# EAGLE design transmisor (EAGLE 7.6.0)
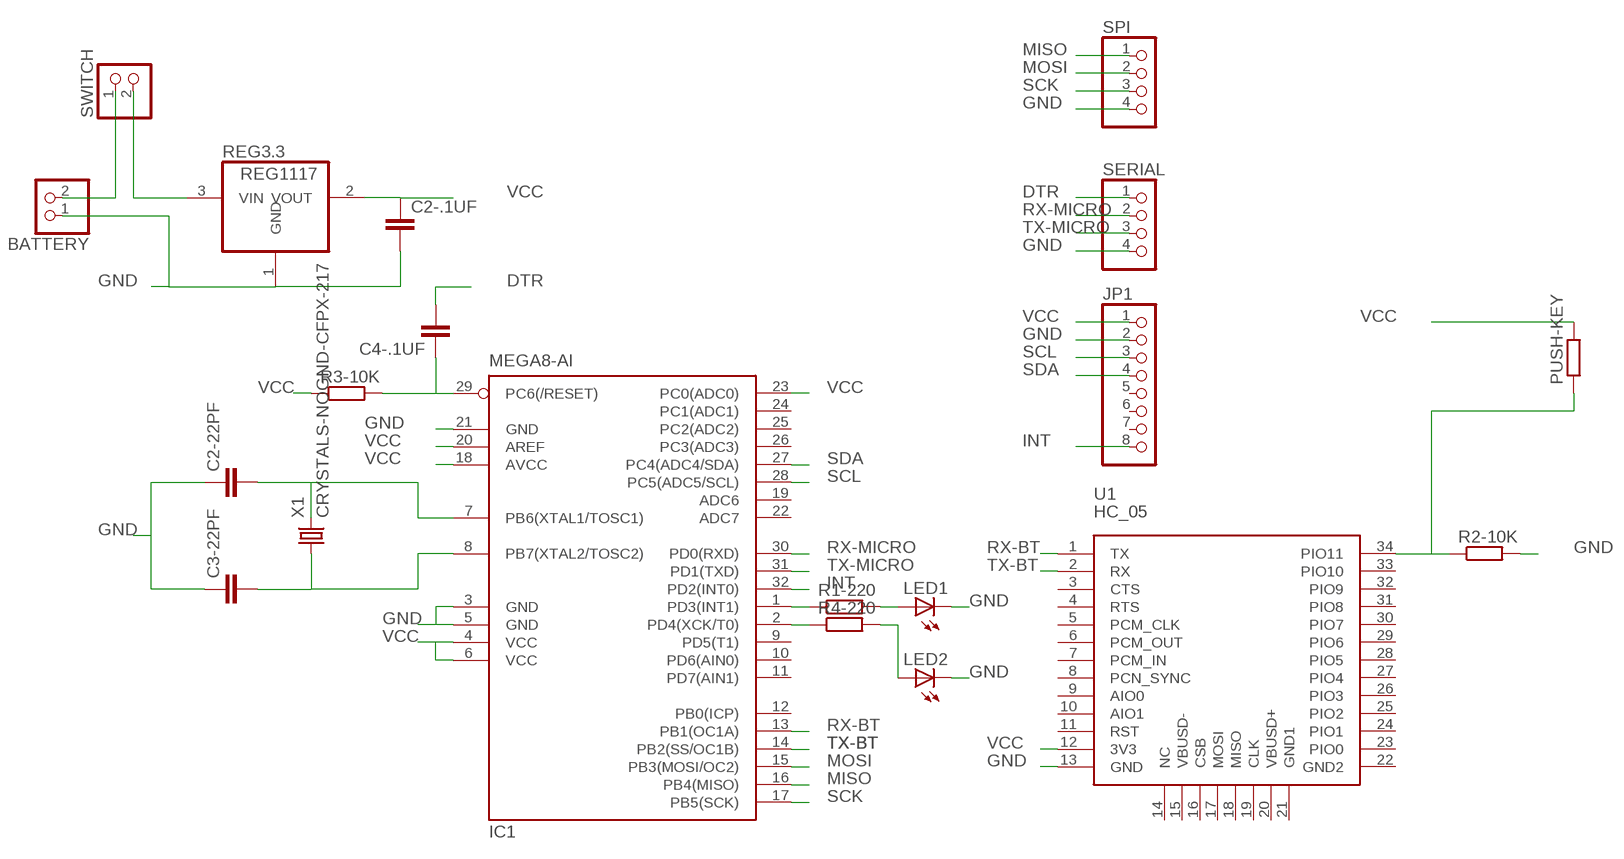
[diagram p0: schematic, sheet 1]

## Parts
BATTERY  PINHD-1X2  [1X02]
C2-22PF  C-EUC0805  [C0805]
C2-.1UF  C-EUC0805  [C0805]
C3-22PF  C-EUC0805  [C0805]
C4-.1UF  C-EUC0805  [C0805]
IC1  MEGA8-AI  [TQFP32-08]
JP1  PINHD-1X8  [1X08]
LED1  LEDMINI-TOP  [OSRAM-MINI-TOP-LED]
LED2  LEDMINI-TOP  [OSRAM-MINI-TOP-LED]
PUSH-KEY  R-EU_M5923  [M5923]
R1-220  R-EU_M0805  [M0805]
R2-10K  R-EU_M0805  [M0805]
R3-10K  R-EU_M0805  [M0805]
R4-220  R-EU_M0805  [M0805]
REG3.3  REG1117  [SOT223]
SERIAL  PINHD-1X4  [1X04]
SPI  PINHD-1X4  [1X04]
SWITCH  PINHD-1X2  [1X02]
U1  HC_05  [BLUETOOTH_SMD]
X1  CRYSTALS-NOGND-CFPX-217  [3.2X1.5-2-PAD]

## Nets
DTR: C4-.1UF.2 SERIAL.1
GND: BATTERY.1 C2-22PF.1 C2-.1UF.2 C3-22PF.1 IC1.3(GND) IC1.5(GND) IC1.21(GND) JP1.2 LED1.C LED2.C R2-10K.2 REG3.3.1(GND) SERIAL.4 SPI.4 U1.13(GND)
INT: IC1.32(PD2(INT0)) JP1.8
MISO: IC1.16(PB4(MISO)) SPI.1
MOSI: IC1.15(PB3(MOSI/OC2)) SPI.2
N$1: IC1.1(PD3(INT1)) R1-220.1
N$2: LED1.A R1-220.2
N$4: C2-22PF.2 IC1.7(PB6(XTAL1/TOSC1)) X1.2
N$5: C3-22PF.2 IC1.8(PB7(XTAL2/TOSC2)) X1.1
N$6: IC1.2(PD4(XCK/T0)) R4-220.1
N$7: LED2.A R4-220.2
N$8: C4-.1UF.1 IC1.29(PC6(/RESET)) R3-10K.2
N$20: PUSH-KEY.1 R2-10K.1 U1.34(PIO11)
N$21: BATTERY.2 SWITCH.1
N$22: REG3.3.3(VIN) SWITCH.2
RX-BT: IC1.13(PB1(OC1A)) U1.1(TX)
RX-MICRO: IC1.30(PD0(RXD)) SERIAL.2
SCK: IC1.17(PB5(SCK)) SPI.3
SCL: IC1.28(PC5(ADC5/SCL)) JP1.3
SDA: IC1.27(PC4(ADC4/SDA)) JP1.4
TX-BT: IC1.14(PB2(SS/OC1B)) U1.2(RX)
TX-MICRO: IC1.31(PD1(TXD)) SERIAL.3
VCC: C2-.1UF.1 IC1.4(VCC) IC1.6(VCC) IC1.18(AVCC) IC1.20(AREF) IC1.23(PC0(ADC0)) JP1.1 PUSH-KEY.2 R3-10K.1 REG3.3.2(VOUT) U1.12(3V3)
Unconnected: IC1.9(PD5(T1)) IC1.10(PD6(AIN0)) IC1.11(PD7(AIN1)) IC1.12(PB0(ICP)) IC1.19(ADC6) IC1.22(ADC7) IC1.24(PC1(ADC1)) IC1.25(PC2(ADC2)) IC1.26(PC3(ADC3)) JP1.5 JP1.6 JP1.7 U1.3(CTS) U1.4(RTS) U1.5(PCM_CLK) U1.6(PCM_OUT) U1.7(PCM_IN) U1.8(PCN_SYNC) U1.9(AIO0) U1.10(AIO1) U1.11(RST) U1.14(NC) U1.15(VBUSD-) U1.16(CSB) U1.17(MOSI) U1.18(MISO) U1.19(CLK) U1.20(VBUSD+) U1.21(GND1) U1.22(GND2) U1.23(PIO0) U1.24(PIO1) U1.25(PIO2) U1.26(PIO3) U1.27(PIO4) U1.28(PIO5) U1.29(PIO6) U1.30(PIO7) U1.31(PIO8) U1.32(PIO9) U1.33(PIO10)

## Library data of the parts
BATTERY SWITCH = pinhead:PINHD-1X2: PIN HEADER
C2-22PF C2-.1UF C3-22PF C4-.1UF = rcl:C-EU: CAPACITOR, European symbol
IC1 = atmel:MEGA8: MICROCONTROLLER 8 Kbytes FLASH, 1 kbytes SRAM, 512 bytes EEPROM, USART, 6-channel 10 bit ADC, 2-channel 8 bit ADC Pin compatible with Atmega48, ATMega88, ATMega168 Source: avr.lbr; MPN: ATMEGA8-16AU; OC_FARNELL: 9171371; OC_NEWARK: 73M8863
JP1 = pinhead:PINHD-1X8: PIN HEADER
LED1 LED2 = led:LED: LED OSRAM: - CHIPLED LG R971, LG N971, LY N971, LG Q971, LY Q971, LO R971, LY R971 LH N974, LH R974 LS Q976, LO Q976, LY Q976 LO Q996 - Hyper CHIPLED LW Q18S LB Q993, LB Q99A, LB R99A - SideLED LS A670, LO A670, LY A670, LG A670, LP A670 LB A673, LV A673, LT A673, LW A673 LH A674 LY A675 LS A676, LA A676, LO A676, LY A676, LW A676 LS A679, LY A679, LG A679 - Hyper Micro SIDELED® LS Y876, LA Y876, LO Y876, LY Y876 LT Y87S - SmartLED LW L88C, LW L88S LB L89C, LB L89S, LG L890 LS L89K, LO L89K, LY L89K LS L896, LA L896, LO L896, LY L896 - TOPLED LS T670, LO T670, LY T670, LG T670, LP T670 LSG T670, LSP T670, LSY T670, LOP T670, LYG T670 LG T671, LOG T671, LSG T671 LB T673, LV T673, LT T673, LW T673 LH T674 LS T676, LA T676, LO T676, LY T676, LB T676, LH T676, LSB T676, LW T676 LB T67C, LV T67C, LT T67C, LS T67K, LO T67K, LY T67K, LW E67C LS E67B, LA E67B, LO E67B, LY E67B, LB E67C, LV E67C, LT E67C LW T67C LS T679, LY T679, LG T679 LS T770, LO T770, LY T770, LG T770, LP T770 LB T773, LV T773, LT T773, LW T773 LH T774 LS E675, LA E675, LY E675, LS T675 LS T776, LA T776, LO T776, LY T776, LB T776 LHGB T686 LT T68C, LB T68C - Hyper Mini TOPLED® LB M676 - Mini TOPLED Santana® LG M470 LS M47K, LO M47K, LY M47K Source: http://www.osram.convergy.de LUXEON: - LUMILED® LXK2-PW12-R00, LXK2-PW12-S00, LXK2-PW14-U00, LXK2-PW14-V00 LXK2-PM12-R00, LXK2-PM12-S00, LXK2-PM14-U00 LXK2-PE12-Q00, LXK2-PE12-R00, LXK2-PE12-S00, LXK2-PE14-T00, LXK2-PE14-U00 LXK2-PB12-K00, LXK2-PB12-L00, LXK2-PB12-M00, LXK2-PB14-N00, LXK2-PB14-P00, LXK2-PB14-Q00 LXK2-PR12-L00, LXK2-PR12-M00, LXK2-PR14-Q00, LXK2-PR14-R00 LXK2-PD12-Q00, LXK2-PD12-R00, LXK2-PD12-S00 LXK2-PH12-R00, LXK2-PH12-S00 LXK2-PL12-P00, LXK2-PL12-Q00, LXK2-PL12-R00 Source: www.luxeon.com KINGBRIGHT: KA-3528ASYC Source: www.kingbright.com
PUSH-KEY = rcl:R-EU_: RESISTOR, European symbol
R1-220 R2-10K R3-10K R4-220 = resistor:R-EU_: RESISTOR, European symbol
REG3.3 = kia1117:REG1117: 800mA and 1A Low Dropout (LDO) Positive Regulator 1.8V, 2.5V, 2.85V, 3.3V, 5V, and Adj; MPN: REG1117; OC_FARNELL: 1097566; OC_NEWARK: 14P6981
SERIAL SPI = pinhead:PINHD-1X4: PIN HEADER
U1 = Bluetooth HC-05:HC_05: HC-05 Bluetooth Module
X1 = IQD-Frequency-Products:CRYSTALS-NOGND: CRYSTALS CAN NOT GROUNDED

## Board
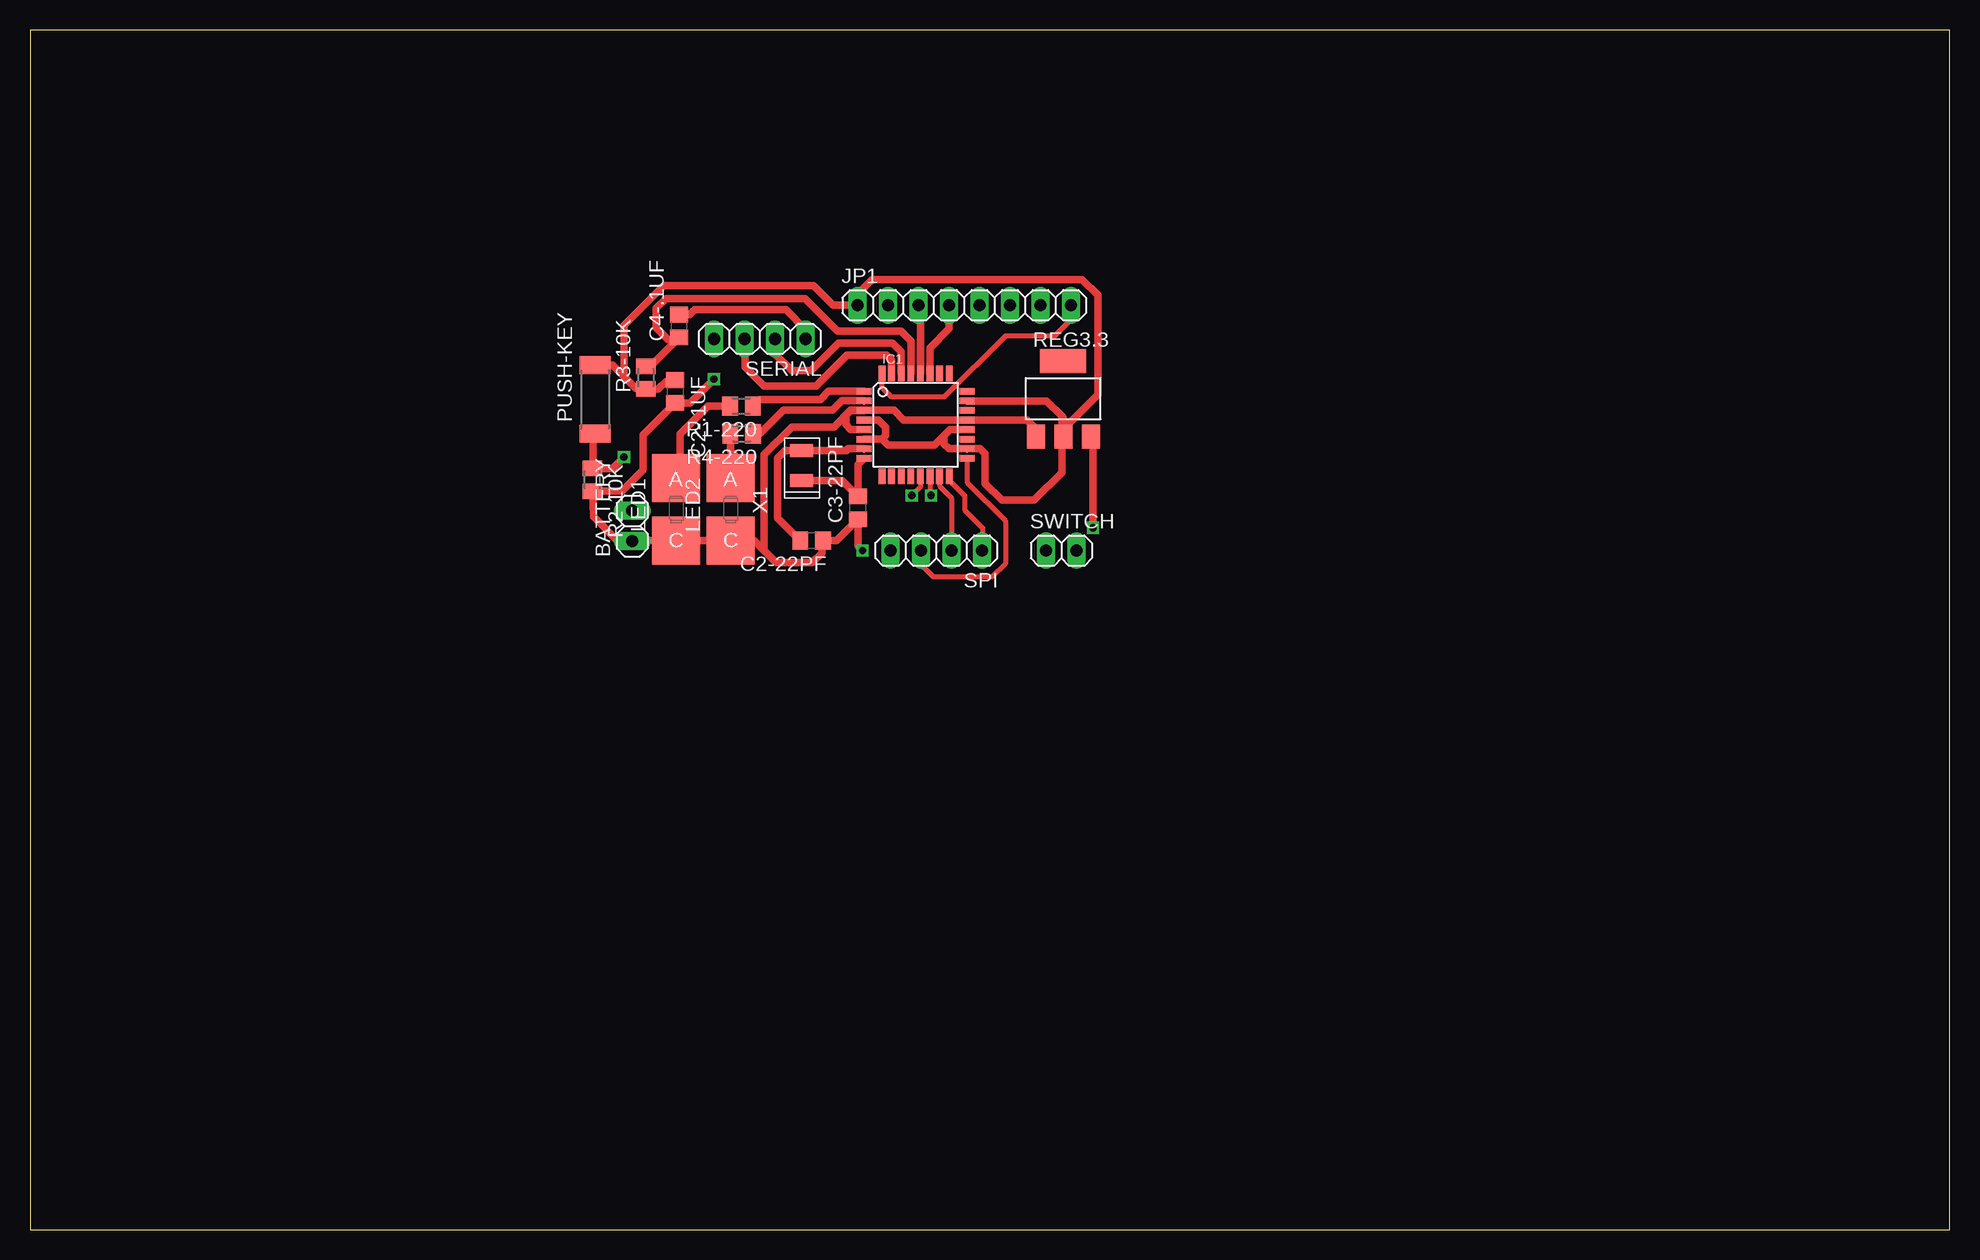
[diagram p1: board, top side]
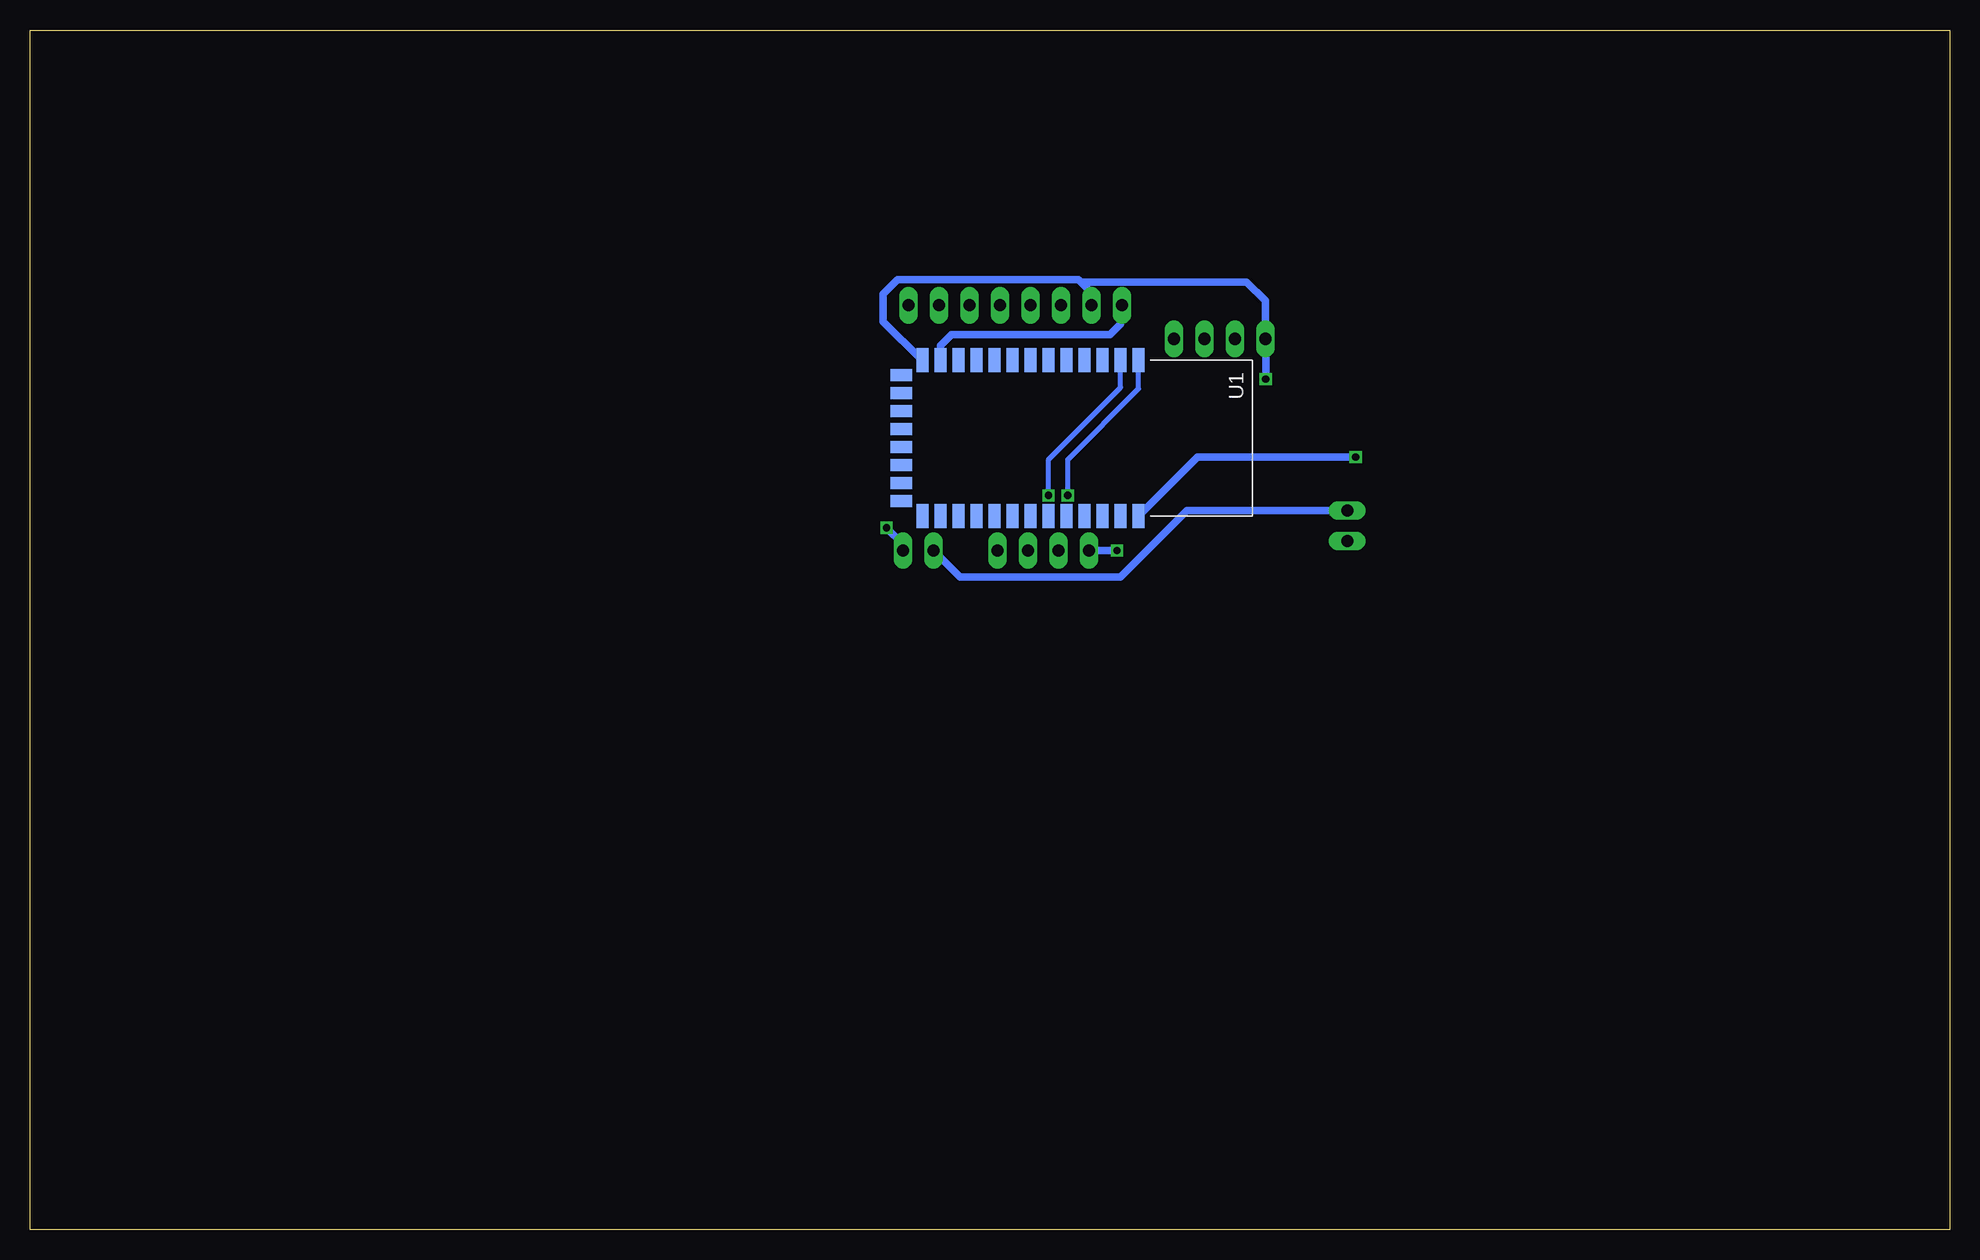
[diagram p2: board, bottom side, seen from below]

Size 160 x 100 mm. Coordinates in mm from the lower left corner, seen from the top.
Outline: 0,0 160,0 160,100 0,100 0,0
Copper layers (1*16): Top 0.035mm / dielectric 1.5mm / Bottom 0.035mm
Design rules "default": minimum track width 10mil, minimum drill 24mil, track to track 8mil, track to pad 8mil, pad to pad 8mil, via to via 8mil, smd to smd 8mil, copper to edge 40mil, drill to drill 8mil, minimum pad ring 10mil, minimum via ring 8mil, stop-mask expansion 4mil, vias tented up to drill 0mil, thermal gap 10mil

### Footprints (pad centres in the part's own frame; a part is rotated, then mirrored left to right if it is on the bottom)
1X02 = drill 1.016 long: 1 -1.27,0; 2 1.27,0
C0805 = smd 1.3 x 1.5: 1 -0.95,0; 2 0.95,0
TQFP32-08 = smd 1.27 x 0.559: 1 -4.293,2.8; 2 -4.293,2; 3 -4.293,1.2; 4 -4.293,0.4; 5 -4.293,-0.4; 6 -4.293,-1.2; 7 -4.293,-2; 8 -4.293,-2.8; 17 4.293,-2.8; 18 4.293,-2; 19 4.293,-1.2; 20 4.293,-0.4; 21 4.293,0.4; 22 4.293,1.2; 23 4.293,2; 24 4.293,2.8 | smd 0.559 x 1.27: 9 -2.8,-4.293; 10 -2,-4.293; 11 -1.2,-4.293; 12 -0.4,-4.293; 13 0.4,-4.293; 14 1.2,-4.293; 15 2,-4.293; 16 2.8,-4.293; 25 2.8,4.293; 26 2,4.293; 27 1.2,4.293; 28 0.4,4.293; 29 -0.4,4.293; 30 -1.2,4.293; 31 -2,4.293; 32 -2.8,4.293
1X08 = drill 1.016 long: 1 -8.89,0; 2 -6.35,0; 3 -3.81,0; 4 -1.27,0; 5 1.27,0; 6 3.81,0; 7 6.35,0; 8 8.89,0
OSRAM-MINI-TOP-LED = smd 4 x 4: A 0,2.6; C 0,-2.6
M5923 = smd 1.5 x 2.6: 1 -2.85,0; 2 2.85,0
M0805 = smd 1.3 x 1.6: 1 -0.95,0; 2 0.95,0
SOT223 = smd 1.499 x 2.007: 1 -2.261,-3.15; 2 0.025,-3.15; 3 2.311,-3.15 | smd 3.81 x 2.007: 4 0,3.15
1X04 = drill 1.016 long: 1 -3.81,0; 2 -1.27,0; 3 1.27,0; 4 3.81,0
BLUETOOTH_SMD = smd 2 x 1: 1 -6.35,3.81; 2 -6.35,2.31; 3 -6.35,0.81; 4 -6.35,-0.69; 5 -6.35,-2.19; 6 -6.35,-3.69; 7 -6.35,-5.19; 8 -6.35,-6.69; 9 -6.35,-8.19; 10 -6.35,-9.69; 11 -6.35,-11.19; 12 -6.35,-12.69; 13 -6.35,-14.19; 22 6.65,-14.19; 23 6.65,-12.69; 24 6.65,-11.19; 25 6.65,-9.69; 26 6.65,-8.19; 27 6.65,-6.69; 28 6.65,-5.19; 29 6.65,-3.69; 30 6.65,-2.19; 31 6.65,-0.69; 32 6.65,0.81; 33 6.65,2.31; 34 6.65,3.81 | smd 1 x 1.8: 14 -5.1,-15.94; 15 -3.6,-15.94; 16 -2.1,-15.94; 17 -0.6,-15.94; 18 0.9,-15.94; 19 2.4,-15.94; 20 3.9,-15.94; 21 5.4,-15.94
3.2X1.5-2-PAD = smd 1.1 x 1.9: 1 -1.25,0; 2 1.25,0

### Placement (x,y rotation side)
BATTERY  50.2,58.66 90 top
C2-22PF  65.15,57.42 180 top
C2-.1UF  53.78,69.86 270 top
C3-22PF  69.02,60.16 90 top
C4-.1UF  54.12,75.32 90 top
IC1  73.82,67.08 0 top
JP1  77.87,77.05 0 top
LED1  53.86,60.03 0 top
LED2  58.41,60.03 0 top
PUSH-KEY  47.1,69.2 90 top
R1-220  59.3,68.64 180 top
R2-10K  46.88,62.5 270 top
R3-10K  51.34,71.02 90 top
R4-220  59.32,66.34 180 top
REG3.3  86.11,69.25 0 top
SERIAL  60.84,74.25 180 top
SPI  75.55,56.6 180 top
SWITCH  85.97,56.6 0 top
U1  71.42,66.11 270 bottom
X1  64.3,63.7 90 top

### Tracks (layer width: path | path; a pad name or v marks a point on that pad's centre or on a via)
DTR
  Top 0.61: C4-.1UF.2 54.97,76.27 55.4,76.7 63,76.7 64.7,75 64.7,74.3 SERIAL.1
GND  (via drill 0.6)
  Top 0.61: 69.55,68.3 72,68.3 72.82,67.48 IC1.21 83.12,67.48 84,66.6 84,66.25 REG3.3.1 | 69.55,68.3 IC1.3 68.38,68.28 68,67.9 68,67.1 68.4,66.7 69.51,66.7 IC1.5 | 61.2,56.6 60.37,57.43 LED2.C LED1.C 50.24,57.43 BATTERY.1 50.09,57.5 48.9,57.5 46.98,59.42 R2-10K.2 49.35,61.55 51.1,63.3 51.1,66.23 C2-.1UF.2 55.01,68.91 v57,70.9 | 61.2,56.6 62.2,55.6 65.2,55.6 66,56.4 66,57.32 C2-22PF.1 67.23,57.42 C3-22PF.1 69.02,56.98 v69.4,56.6 | 69.55,68.3 68.4,68.3 67,66.9 63.5,66.9 61.2,64.6 61.2,56.6
  Bottom 0.61: v69.4,56.6 SPI.4 | U1.13 85.66,72.46 88.9,75.7 88.9,78 87.7,79.2 72.6,79.2 72.4,79 | 72.4,79 71.6,78.2 71.6,77.13 JP1.2 | 72.4,79 58.6,79 57.03,77.43 SERIAL.4 57,74.22 v57,70.9
INT
  Top 0.406: JP1.8 86.76,75.86 85.4,74.5 81.3,74.5 76.2,69.4 71.8,69.4 71,70.2 71,71.35 IC1.32
MISO
  Top 0.406: IC1.16 76.62,62.48 77.9,61.2 77.9,60 79.4,58.5 79.4,56.64 SPI.1
MOSI
  Top 0.406: IC1.15 75.82,61.98 76.8,61 76.8,56.62 SPI.2
N$1
  Top 0.61: IC1.1 66.58,69.88 65.9,69.2 60.81,69.2 R1-220.1
N$2
  Top 0.61: R1-220.2 56.54,68.64 54.2,66.3 54.2,62.79 LED1.A
N$4
  Top 0.61: IC1.7 69.51,65.1 68.2,65.1 68.05,64.95 X1.2 62.95,64.95 62.3,64.3 62.3,59.32 C2-22PF.2
N$5
  Top 0.61: X1.1 67.68,62.45 C3-22PF.2 69.02,63.77 IC1.8
N$6
  Top 0.61: R4-220.1 60.84,66.34 62.8,68.3 66.9,68.3 67.7,69.1 69.51,69.1 IC1.2
N$7
  Top 0.61: LED2.A 59.11,64.19 58.4,64.9 58.4,66.31 R4-220.2
N$8
  Top 0.61: IC1.29 73.42,74.08 72.6,74.9 67.3,74.9 64.6,77.6 53,77.6 52.2,76.8 52.2,75.2 53.2,74.2 53.95,74.2 C4-.1UF.1 51.72,71.97 R3-10K.2
N$20  (via drill 0.6)
  Top 0.61: PUSH-KEY.1 46.98,66.23 R2-10K.1 48.55,63.45 v49.5,64.4
  Bottom 0.61: v49.5,64.4 62.67,64.4 U1.34
N$21
  Bottom 0.61: BATTERY.2 63.57,59.93 69.1,54.4 82.5,54.4 SWITCH.1
N$22  (via drill 0.6)
  Top 0.61: v88.6,58.5 88.6,65.92 REG3.3.3
  Bottom 0.61: SWITCH.2 87.24,57.14 v88.6,58.5
RX-BT  (via drill 0.6)
  Top 0.406: IC1.13 74.22,61.92 v73.5,61.2
  Bottom 0.406: v73.5,61.2 73.5,64.2 67.6,70.1 U1.1
RX-MICRO
  Top 0.61: IC1.30 72.62,73.18 71.9,73.9 67.4,73.9 65.1,71.6 63.5,71.6 62.1,73 SERIAL.2
SCK
  Top 0.406: IC1.17 78.11,62.29 81.3,59.1 81.3,55.5 80.2,54.4 75.3,54.4 74.3,55.4 74.3,56.58 SPI.3
SCL
  Top 0.61: IC1.28 74.22,76.89 JP1.3
SDA
  Top 0.61: JP1.4 76.6,75.1 75,73.5 75,71.39 IC1.27
TX-BT  (via drill 0.6)
  Top 0.406: IC1.14 75.02,61.28 v75.1,61.2
  Bottom 0.406: v75.1,61.2 75.1,64.2 69.1,70.2 U1.2
TX-MICRO
  Top 0.61: IC1.31 71.82,72.48 71.4,72.9 68.1,72.9 65.5,70.3 61.2,70.3 59.6,71.9 59.6,74.22 SERIAL.3
VCC
  Top 0.61: IC1.4 70.72,67.48 71.3,66.9 71.3,66.2 71,65.9 | 71,65.9 69.55,65.9 IC1.6 | 76.2,66.2 76.68,66.68 IC1.20 | 76.2,66.2 76.2,65.5 76.6,65.1 78.09,65.1 IC1.18 78.13,65.1 79.2,65.1 79.6,64.7 79.6,62.2 81,60.8 83.7,60.8 86,63.1 86,67.8 | 76.2,66.2 75.4,65.4 71.5,65.4 71,65.9 | C2-.1UF.1 53.67,70.7 53,70.7 52.37,70.07 R3-10K.1 51.31,70.1 50.5,70.1 49.5,71.1 | 49.5,71.1 49.5,75.4 52.8,78.7 65.3,78.7 66.95,77.05 JP1.1 68.98,77.98 70.2,79.2 87.7,79.2 89,77.9 89,69.6 86.1,66.7 | 86,67.8 86.1,67.7 86.1,66.7 | 86.1,66.7 86.1,66.14 REG3.3.2 | IC1.23 84.72,69.08 86,67.8 | PUSH-KEY.2 48.55,72.05 49.5,71.1
  Bottom 0.61: U1.12 84.11,73.69 83.2,74.6 70,74.6 69.1,75.5 69.1,76.93 JP1.1